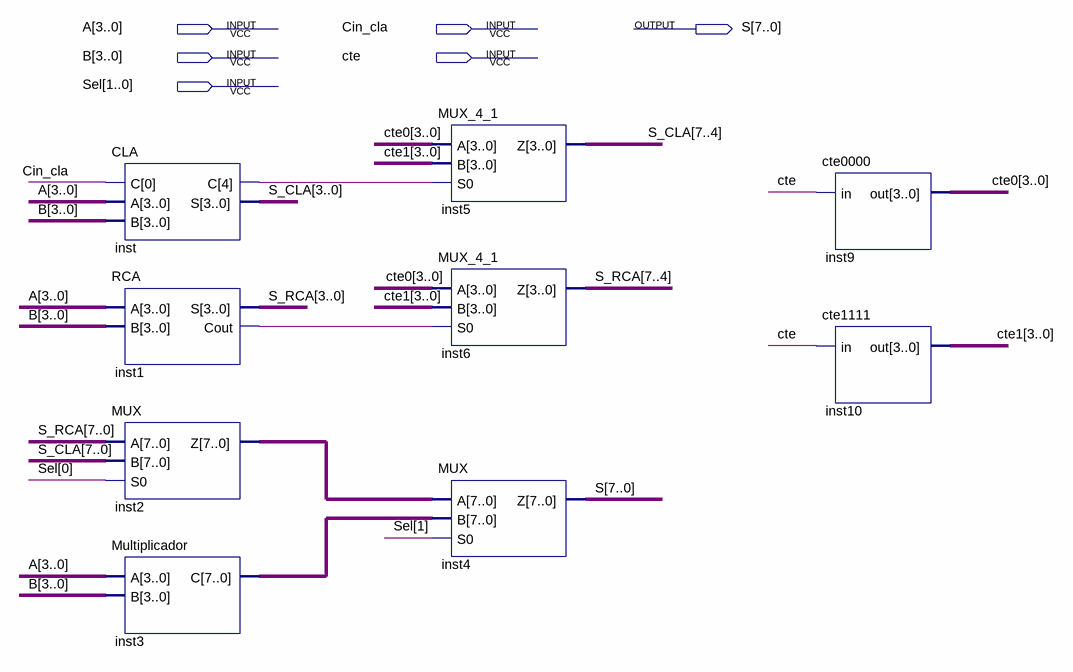
[diagram p0: schematic sheet]
// Quartus schematic ULA.bdf as structural Verilog: 9 symbols, 6 pins
module ULA (
  input  [3:0] A,
  input  Cin_cla,
  input  [3:0] B,
  input  cte,
  input  [1:0] Sel,
  output [7:0] S
);

  wire inst1_cout, inst_c;
  wire [3:0] cte0, cte1;
  wire [7:0] inst2_z, inst3_c, S_CLA, S_RCA;

  CLA inst (.C({inst_c, Cin_cla}), .A(A), .B(B), .S(S_CLA[3:0]));
  RCA inst1 (.A(A), .B(B), .S(S_RCA[3:0]), .Cout(inst1_cout));
  MUX inst2 (.A(S_RCA), .B(S_CLA), .S0(Sel[0]), .Z(inst2_z));
  Multiplicador inst3 (.A(A), .B(B), .C(inst3_c));
  MUX_4_1 inst5 (.A(cte0), .B(cte1), .S0(inst_c), .Z(S_CLA[7:4]));
  MUX_4_1 inst6 (.A(cte0), .B(cte1), .S0(inst1_cout), .Z(S_RCA[7:4]));
  MUX inst4 (.A(inst2_z), .B(inst3_c), .S0(Sel[1]), .Z(S));
  cte0000 inst9 (.in(cte), .out(cte0));
  cte1111 inst10 (.in(cte), .out(cte1));
endmodule
